# Altium schematic sheet LCD.SchDoc
size A4; Organization: Altium Limited; Address1: L3, 12a Rodborough Rd; Address2: Frenchs Forest; Address3: NSW; Address4: Australia 2086
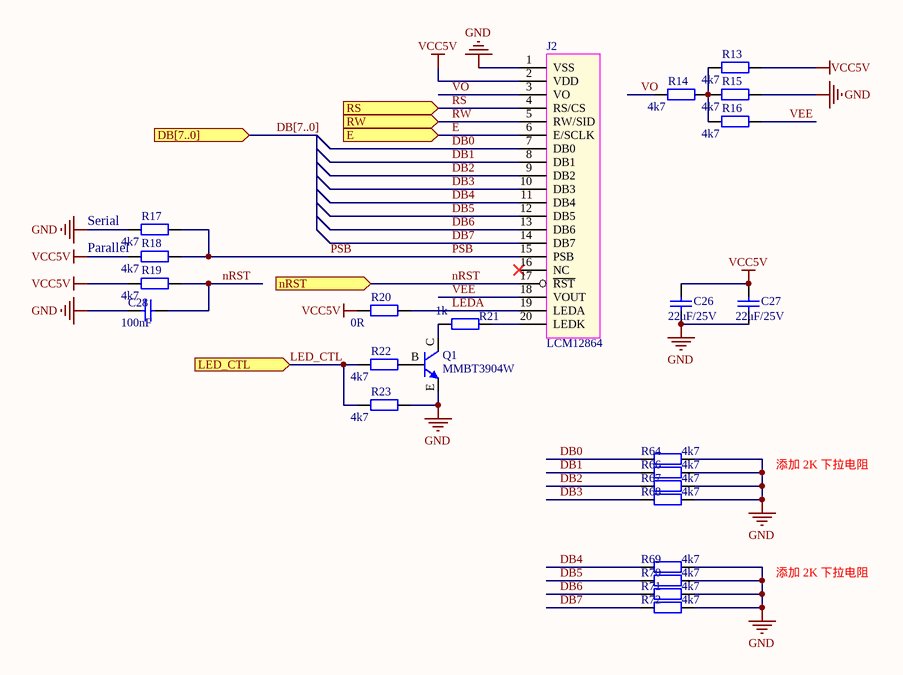
[diagram p0: LCD.SchDoc]

## Parts
C26  22uF/25V  [C0805]
C27  22uF/25V  [C0805]
C28  100nF  [R0603]
J2  LCM12864  [LCD12864]
Q1  MMBT3904W  [SOT_23]
R13  4k7  [R0603]
R14  4k7  [R0603]
R15  4k7  [R0603]
R16  4k7  [R0603]
R17  4k7  [R0603]
R18  4k7  [R0603]
R19  4k7  [R0603]
R20  0R  [R0603]
R21  1k  [R0603]
R22  4k7  [R0603]
R23  4k7  [R0603]
R64  4k7  [R0603]
R66  4k7  [R0603]
R67  4k7  [R0603]
R68  4k7  [R0603]
R69  4k7  [R0603]
R70  4k7  [R0603]
R71  4k7  [R0603]
R72  4k7  [R0603]

## Ports
DB[7..0] (in), E (in), LED_CTL (in), nRST (in), RS (in), RW (in)

## Nets
GND: C26.1 C27.1 C28.1 J2.1(VSS) Q1.E R15.2 R17.1 R23.2 R64.2 R66.2 R67.2 R68.2 R69.2 R70.2 R71.2 R72.2
VCC5V: C26.2 C27.2 J2.2(VDD) R13.2 R18.1 R19.1 R20.1
DB0: J2.7(DB0) R64.1
DB1: J2.8(DB1) R66.1
DB2: J2.9(DB2) R67.1
DB3: J2.10(DB3) R68.1
DB4: J2.11(DB4) R69.1
DB5: J2.12(DB5) R70.1
DB6: J2.13(DB6) R71.1
DB7: J2.14(DB7) R72.1
E: J2.6(E/SCLK) ; port E
LED_CTL: R22.1 R23.1 ; port LED_CTL
LEDA: J2.19(LEDA) R20.2
nRST: C28.2 J2.17(~{RST}) R19.2 ; port nRST
PSB: J2.15(PSB) R17.2 R18.2
RS: J2.4(RS/CS) ; port RS
RW: J2.5(RW/SID) ; port RW
VEE: J2.18(VOUT) R16.2
VO: J2.3(VO) R14.1
NetJ2_20: J2.20(LEDK) R21.2
NetQ1_B: Q1.B R22.2
NetQ1_C: Q1.C R21.1
NetR13_1: R13.1 R14.2 R15.1 R16.1

Not connected (* = marked no-connect by the designer): J2 16(NC)*

## Buses and harness runs
bus DB[7..0] = port DB[7..0]

## Notes on the sheet
- (near R17) Serial
- (near R18) Parallel
- 添加 2K 下拉电阻
- Title
- Size:
- Date:
- A4
- Number:
- Time:
- Revision:
- Sheet
- of
- File:

## Library data of the parts
C26 C27 = CAP_08
C28 = CAP_04: Value: 100nF
J2 = LCM12864: ST7920/LCM12864
Q1 = MMBT3904TT1G
R13-R19 R21-R23 R64 R66-R72 = RES_04
  R13-R19: Value: 4K7
  R21: Value: 1k
  R22 R23 R64 R66-R72: Value: 4k7
R20 = RES_04: Value: 0